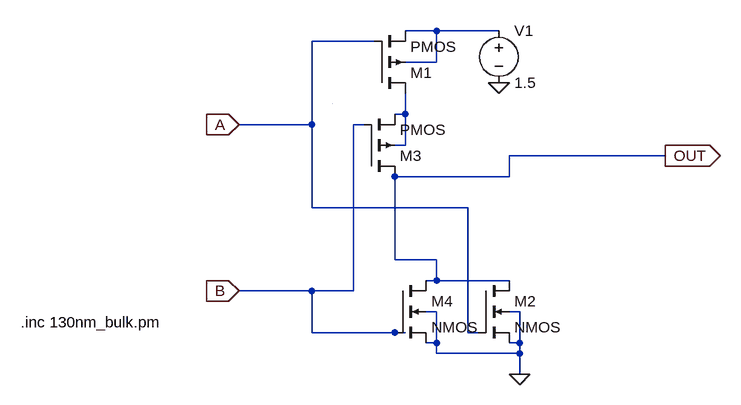
[diagram p0: schematic NOR.asc]
NOR.asc, the LTspice schematic file:
Version 4
SHEET 1 880 680
WIRE 160 -112 112 -112
WIRE 256 -112 160 -112
WIRE 64 -96 -32 -96
WIRE 160 -64 160 -112
WIRE 160 -64 112 -64
WIRE 112 16 112 -16
WIRE 112 16 96 16
WIRE -32 32 -32 -96
WIRE -32 32 -144 32
WIRE 48 32 32 32
WIRE 112 64 112 16
WIRE 112 64 96 64
WIRE 512 80 272 80
WIRE 272 112 272 80
WIRE 272 112 96 112
WIRE -32 160 -32 32
WIRE 208 160 -32 160
WIRE 96 240 96 112
WIRE 160 240 96 240
WIRE 160 272 160 240
WIRE 160 272 144 272
WIRE 272 272 160 272
WIRE -32 288 -144 288
WIRE 32 288 32 32
WIRE 32 288 -32 288
WIRE 160 320 144 320
WIRE 288 320 272 320
WIRE -32 352 -32 288
WIRE 96 352 -32 352
WIRE 112 352 96 352
WIRE 208 352 208 160
WIRE 224 352 208 352
WIRE 160 368 160 320
WIRE 160 368 144 368
WIRE 288 368 288 320
WIRE 288 368 272 368
WIRE 160 384 160 368
WIRE 288 384 288 368
WIRE 288 384 160 384
WIRE 288 416 288 384
WIRE 0 0 0 0
FLAG 288 416 0
FLAG 256 -32 0
FLAG 512 80 OUT
IOPIN 512 80 Out
FLAG -144 32 A
IOPIN -144 32 In
FLAG -144 288 B
IOPIN -144 288 In
SYMBOL pmos4 64 -16 M180
SYMATTR InstName M1
SYMATTR Value2 l=130e-9 w=2600e-9 ad=676000e-18 as=676000e-18 pd=3640e-9 ps=3640e-9
SYMBOL nmos4 224 272 R0
SYMATTR InstName M2
SYMATTR Value2 l=130e-9 w=1300e-9 ad=676000e-18 as=676000e-18 pd=3640e-9 ps=3640e-9
SYMBOL pmos4 48 112 M180
SYMATTR InstName M3
SYMATTR Value2 l=130e-9 w=2600e-9 ad=676000e-18 as=676000e-18 pd=3640e-9 ps=3640e-9
SYMBOL nmos4 96 272 R0
SYMATTR InstName M4
SYMATTR Value2 l=130e-9 w=1300e-9 ad=676000e-18 as=676000e-18 pd=3640e-9 ps=3640e-9
SYMBOL voltage 256 -128 R0
WINDOW 123 0 0 Left 0
WINDOW 39 0 0 Left 0
SYMATTR InstName V1
SYMATTR Value 1.5
TEXT -480 336 Left 2 !.inc 130nm_bulk.pm

The netlist it stands for:
* NOR.asc
M1 N002 A N001 N001 PMOS l=130e-9 w=2600e-9 ad=676000e-18 as=676000e-18 pd=3640e-9 ps=3640e-9
M2 OUT A 0 0 NMOS l=130e-9 w=1300e-9 ad=676000e-18 as=676000e-18 pd=3640e-9 ps=3640e-9
M3 OUT B N002 N002 PMOS l=130e-9 w=2600e-9 ad=676000e-18 as=676000e-18 pd=3640e-9 ps=3640e-9
M4 OUT B 0 0 NMOS l=130e-9 w=1300e-9 ad=676000e-18 as=676000e-18 pd=3640e-9 ps=3640e-9
V1 N001 0 1.5
.model NMOS NMOS
.model PMOS PMOS
.lib standard.mos
.inc 130nm_bulk.pm
.backanno
.end